# EAGLE design clock (EAGLE 9.6.1)
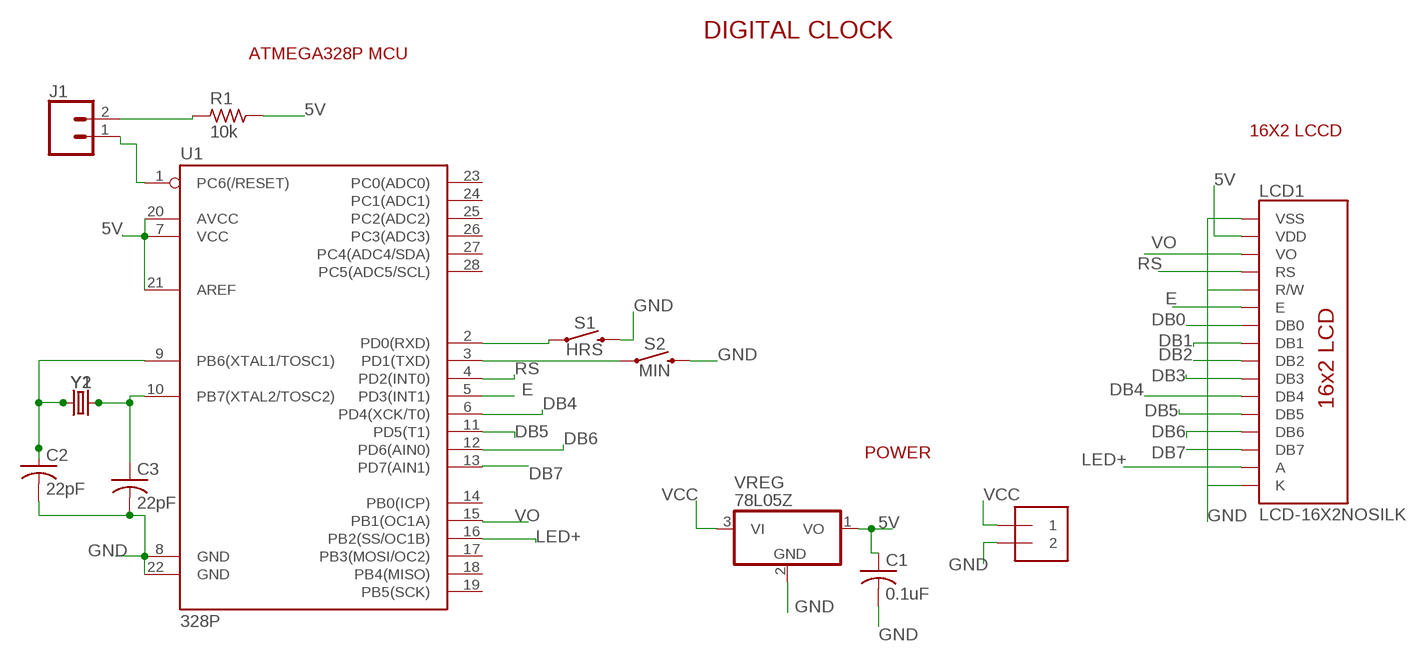
[diagram p0: schematic, sheet 1]

## Parts
C1  0.1uF  C-USC1206  [C1206]
C2  22pF  C-USC1206  [C1206]
C3  22pF  C-USC1206  [C1206]
J1  CONN_02  [1X02]
LCD1  LCD-16X2NOSILK  [LCD-16X2_NOSILK]
POWER  1X2-3.5MM  [1X2-3.5MM]
R1  10k  R_1206  [R1206]
S1  HRS  MOMENTARY-SWITCH-SPST-PTH-6.0MM  [TACTILE_SWITCH_PTH_6.0MM]
S2  MIN  MOMENTARY-SWITCH-SPST-PTH-6.0MM  [TACTILE_SWITCH_PTH_6.0MM]
U1  328P  ATMEGA328P_PDIP  [DIP28]
VREG  78L05Z  [TO92]
Y1  CRYSTALPTH-HC49US  [HC49US]
Y2  CRYSTALPTH-HC49US  [HC49US]

## Nets
5V: C1.1 LCD1.2(VDD) R1.2 U1.7(VCC) U1.20(AVCC) U1.21(AREF) VREG.1(VO)
DB0: LCD1.7(DB0)
DB1: LCD1.8(DB1)
DB2: LCD1.9(DB2)
DB3: LCD1.10(DB3)
DB4: LCD1.11(DB4) U1.6(PD4(XCK/T0))
DB5: LCD1.12(DB5) U1.11(PD5(T1))
DB6: LCD1.13(DB6) U1.12(PD6(AIN0))
DB7: LCD1.14(DB7) U1.13(PD7(AIN1))
E: LCD1.6(E) U1.5(PD3(INT1))
GND: C1.2 C2.1 C2.2 C3.2 LCD1.16(K) POWER.2 S1.3 S2.3 U1.8(GND) U1.9(PB6(XTAL1/TOSC1)) U1.22(GND) VREG.2(GND) Y1.1 Y2.1
LED+: LCD1.15(A) U1.16(PB2(SS/OC1B))
N$1: LCD1.1(VSS) LCD1.5(R/W)
N$2: S1.1 U1.2(PD0(RXD))
N$3: S2.1 U1.3(PD1(TXD))
N$4: J1.1 U1.1(PC6(/RESET))
N$5: J1.2 R1.1
N$6: C3.1 U1.10(PB7(XTAL2/TOSC2)) Y1.2 Y2.2
RS: LCD1.4(RS) U1.4(PD2(INT0))
VCC: POWER.1 VREG.3(VI)
VO: LCD1.3(VO) U1.15(PB1(OC1A))
Unconnected: U1.14(PB0(ICP)) U1.17(PB3(MOSI/OC2)) U1.18(PB4(MISO)) U1.19(PB5(SCK)) U1.23(PC0(ADC0)) U1.24(PC1(ADC1)) U1.25(PC2(ADC2)) U1.26(PC3(ADC3)) U1.27(PC4(ADC4/SDA)) U1.28(PC5(ADC5/SCL))

## Notes on the sheet
- DIGITAL CLOCK
- ATMEGA328P MCU
- 16X2 LCCD
- POWER

## Library data of the parts
C1-C3 = adafruit:C-US: CAPACITOR, American symbol
J1 = SparkFun-Connectors:CONN_02: Multi connection point. Often used as Generic Header-pin footprint for 0.1 inch spaced/style header connections On any of the 0.1 inch spaced packages, you can populate with these: Break Away Headers - Straight <https://www.sparkfun.com/products/116> (PRT-00116) Break Away Male Headers - Right Angle <https://www.sparkfun.com/products/553> (PRT-00553) Female Headers <https://www.sparkfun.com/products/115> (PRT-00115) Break Away Headers - Machine Pin <https://www.sparkfun.com/products/117> (PRT-00117) Break Away Female Headers - Swiss Machine Pin <https://www.sparkfun.com/products/743> (PRT-00743) For SCREWTERMINALS and SPRING TERMINALS visit here: Screw Terimnals on SparkFun.com <https://www.sparkfun.com/search/results?term=Screw+Terminals> (5mm/3.5mm/2.54mm spacing) This device is also useful as a general connection point to wire up your design to another part of your project. Our various solder wires solder well into these plated through hole pads. Hook-Up Wire - Assortment (Stranded, 22 AWG) <https://www.sparkfun.com/products/11375> (PRT-11375) Hook-Up Wire - Assortment (Solid Core, 22 AWG) <https://www.sparkfun.com/products/11367> (PRT-11367) View the entire wire category on our website here <https://www.sparkfun.com/categories/141> Special notes: Molex polarized connector foot print use with: PRT-08233 with associated crimp pins and housings. 2.54_SCREWTERM for use with PRT-10571. 3.5mm Screw Terminal footprints for PRT-08084 5mm Screw Terminal footprints for use with PRT-08432
LCD1 = SparkFun-Displays:LCD-16X2: Standard text-only 16x2 parallel input LCD Basic 16 character by 2 line display. Typically utilizes the extremely common HD44780 parallel interface chipset SparkFun Products: Basic 16x2 Green <https://www.sparkfun.com/products/255> Basic 8x2 Green <https://www.sparkfun.com/products/11122>; SF_ID: LCD-00255
POWER = adafruit:1X2: 3.5mm Terminal block http://www.ladyada.net/library/pcb/eaglelibrary.html
R1 = rc-master-smd:R_: RESISTOR
S1 S2 = SparkFun-Switches:MOMENTARY-SWITCH-SPST: Momentary Switch (Pushbutton) - SPST Normally-open (NO) SPST momentary switches (buttons, pushbuttons). Variants PTH-12MM - 12mm square, through-hole Momentary Pushbutton Switch - 12mm Square <https://www.sparkfun.com/products/9190> (COM-09190) PTH-6.0MM, PTH-6.0MM-KIT - 6.0mm square, through-hole Mini Pushbutton Switch <https://www.sparkfun.com/products/97> (COM-00097) KIT package intended for soldering kit's - only one side of pads' copper is exposed. PTH-RIGHT-ANGLE-KIT - Right-angle, through-hole Right Angle Tactile Button <https://www.sparkfun.com/products/10791> - Used on SparkFun BigTime Watch Kit <https://www.sparkfun.com/products/11734> SMD-12MM - 12mm square, surface-mount Tactile Button - SMD (12mm) <https://www.sparkfun.com/products/12993> (COM-12993) Used on SparkFun PicoBoard <https://www.sparkfun.com/products/11888> SMD-4.5MM - 4.5mm Square Trackball Switch Used on SparkFun Blackberry Trackballer Breakout <https://www.sparkfun.com/products/13169> SMD-4.6MMX2.8MM - 4.60mm x 2.80mm, surface mount Used on SparkFun SAMD21 Mini Breakout <https://www.sparkfun.com/products/13664> SMD-5.2MM, SMD-5.2-REDUNDANT - 5.2mm square, surface-mount Mini Pushbutton Switch - SMD <https://www.sparkfun.com/products/8720> (COM-08720) Used on Arduino Pro Mini <https://www.sparkfun.com/products/11114> REDUNDANT package connects both switch circuits together SMD-6.0X3.5MM - 6.0 x 3.5mm, surface mount Momentary Reset Switch SMD <https://www.sparkfun.com/products/8229> (COM-08229) SMD-6.2MM-TALL - 6.2mm square, surface mount Tactile Button - SMD (6mm) <https://www.sparkfun.com/products/12992> Used on SparkFun Digital Sandbox <https://www.sparkfun.com/products/12651> SMD-RIGHT-ANGLE - Right-angle, surface mount Used on SparkFun Block for Intel® Edison - Arduino <https://www.sparkfun.com/products/13036>; PROD_ID: SWCH-08441; SF_SKU: COM-00097
U1 = SparkFun-IC-Microcontroller:ATMEGA328P_PDIP: Atmel 328P Through hole ATMEGA328P uC used in the Arduino 32kb flash, 1k EEPROM, 2k SRAM Datasheet <http://www.sparkfun.com/datasheets/Components/SMD/ATMega328.pdf> SparkFun Products Storefront component: AVR 28 Pin 20MHz 32K 6A/D - ATMega328P <https://www.sparkfun.com/products/9061> (COM-09061) SparkFun Simon Says - Through-Hole Soldering Kit <https://www.sparkfun.com/products/10547> (KIT-10547) SparkFun Learn to Solder - Simon Says <https://www.sparkfun.com/products/13708> (KIT-13708) SparkFun BigTime Watch Kit <https://www.sparkfun.com/products/11734> (KIT-11734) SparkFun ClockIt <https://www.sparkfun.com/products/10930> (KIT-10930) SparkFun Serial Enabled LCD Kit <https://www.sparkfun.com/products/10097> (LCD-10097) SparkFun Simon Tilts - Through Hole Soldering Kit <https://www.sparkfun.com/products/12634> (KIT-12634) SparkFun Frequency Counter Kit <https://www.sparkfun.com/products/10140> (KIT-10140) FabFM Radio Kit <https://www.sparkfun.com/products/11043> (KIT-11043) SparkFun Binary Blaster Kit <https://www.sparkfun.com/products/12037> (KIT-12037) SparkFun Metro-Gnome <https://www.sparkfun.com/products/9236> (KIT-09236) ATmega328 with Arduino Optiboot (Uno) <https://www.sparkfun.com/products/10524> (DEV-10524); PROD_ID: IC-09136
VREG = adafruit:78*: Positive VOLTAGE REGULATOR Added bigger pads to the TO-92 package
Y1 Y2 = SparkFun-Clocks:CRYSTAL: Crystals (Generic) These are passive quartz crystals, which can be used as a clock source for a microcontroller. Crystal's are two-terminal devices. They require external "load" capacitors to generate an oscillating signal.

## Board
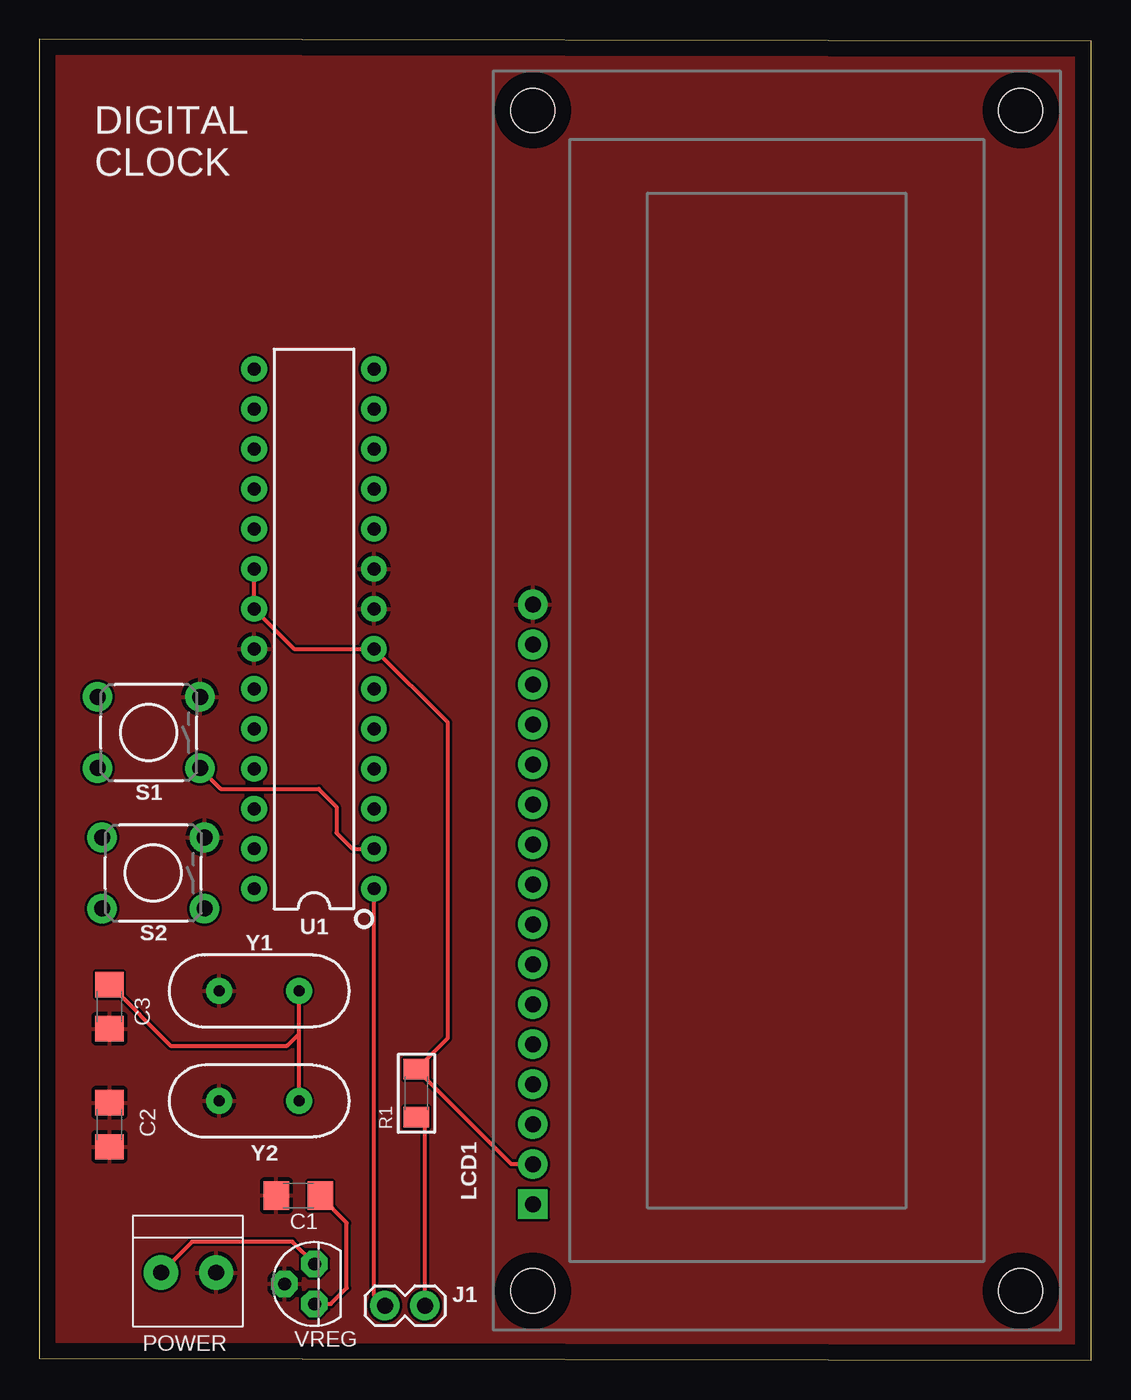
[diagram p1: board, top side]
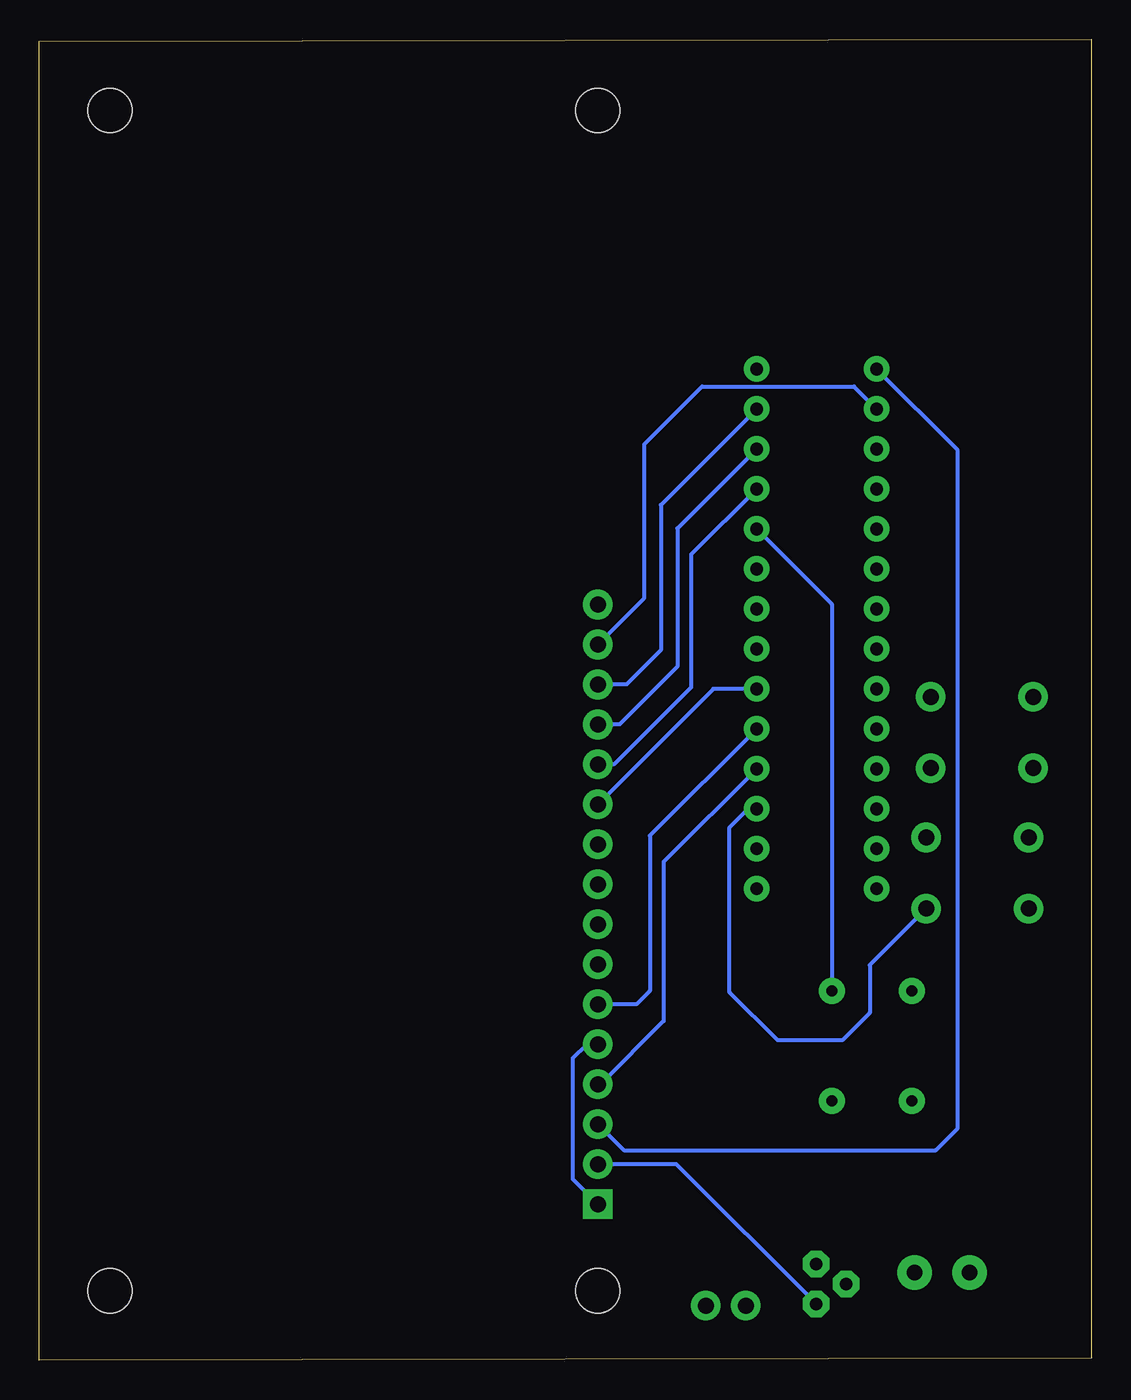
[diagram p2: board, bottom side, seen from below]

Size 66.85 x 83.92 mm. Coordinates in mm from the lower left corner, seen from the top.
Outline: 0,0.11 66.85,0 66.85,83.81 0,83.92 0,0.11
Copper layers (1*16): Top 0.035mm / dielectric 1.5mm / Bottom 0.035mm
Design rules "default": minimum track width 6mil, minimum drill 0.35mm, track to track 6mil, track to pad 6mil, pad to pad 6mil, via to via 6mil, smd to smd 6mil, copper to edge 40mil, drill to drill 6mil, minimum pad ring 10mil, minimum via ring 8mil, stop-mask expansion 4mil, vias tented up to drill 0mil, thermal gap 10mil

### Footprints (pad centres in the part's own frame; a part is rotated, then mirrored left to right if it is on the bottom)
C1206 = smd 1.6 x 1.8: 1 -1.4,0; 2 1.4,0
1X02 = drill 1.016 pad 1.88: 1 0,0; 2 2.54,0
LCD-16X2_NOSILK = drill 1.016 pad 1.88 square: 1 -32,15.5 | drill 1.016 pad 1.88: 2 -29.46,15.5; 3 -26.92,15.5; 4 -24.38,15.5; 5 -21.84,15.5; 6 -19.3,15.5; 7 -16.76,15.5; 8 -14.22,15.5; 9 -11.68,15.5; 10 -9.14,15.5; 11 -6.6,15.5; 12 -4.06,15.5; 13 -1.52,15.5; 14 1.02,15.5; 15 3.56,15.5; 16 6.1,15.5 | hole 2.8: -37.5,15.5; -37.5,-15.5; 37.5,15.5; 37.5,-15.5
1X2-3.5MM = drill 1 pad 2.184: 1 1.8,0; 2 -1.7,0
R1206 = smd 1.3 x 1.6: 1 -1.524,0; 2 1.524,0
TACTILE_SWITCH_PTH_6.0MM = drill 1.016 pad 1.88: 1 -3.251,2.261; 2 3.251,2.261; 3 -3.251,-2.261; 4 3.251,-2.261
DIP28 = drill 0.813 pad 1.626: 1 -16.51,-3.81; 2 -13.97,-3.81; 3 -11.43,-3.81; 4 -8.89,-3.81; 5 -6.35,-3.81; 6 -3.81,-3.81; 7 -1.27,-3.81; 8 1.27,-3.81; 9 3.81,-3.81; 10 6.35,-3.81; 11 8.89,-3.81; 12 11.43,-3.81; 13 13.97,-3.81; 14 16.51,-3.81; 15 16.51,3.81; 16 13.97,3.81; 17 11.43,3.81; 18 8.89,3.81; 19 6.35,3.81; 20 3.81,3.81; 21 1.27,3.81; 22 -1.27,3.81; 23 -3.81,3.81; 24 -6.35,3.81; 25 -8.89,3.81; 26 -11.43,3.81; 27 -13.97,3.81; 28 -16.51,3.81
TO92 = drill 0.813 pad 1.676 octagon: 1 -1.27,0; 2 0,1.905; 3 1.27,0
HC49US = drill 0.7 pad 1.651: 1 -2.54,0; 2 2.54,0

### Placement (x,y rotation side)
C1  16.46,10.46 180 top
C2  4.46,14.96 270 top
C3  4.46,22.46 270 top
J1  21.96,3.46 0 top
LCD1  46.86,41.91 90 top
POWER  9.54,5.56 180 top
R1  23.96,16.96 90 top
S1  6.95,39.88 180 top
S2  7.24,30.95 180 top
U1  17.46,46.46 90 top
VREG  17.49,4.84 90 top
Y1  13.96,23.46 0 top
Y2  13.96,16.46 0 top

### Tracks (layer width: path | path; a pad name or v marks a point on that pad's centre or on a via)
5V
  Top 0.254: LCD1.2 29.99,12.45 R1.2 25.96,20.48 25.96,23.03 25.96,23.21 25.96,40.5 U1.7 16.19,45.19 U1.21 U1.20 | VREG.1 18.51,3.57 19.54,4.59 19.54,8.72 17.86,10.4 C1.1
  Bottom 0.254: VREG.1 26.37,12.45 LCD1.2
DB4
  Bottom 0.254: U1.6 24.02,42.65 LCD1.11
DB5
  Bottom 0.254: U1.11 25.43,51.19 25.43,42.75 30.33,37.85 LCD1.12
DB6
  Bottom 0.254: U1.12 26.3,52.85 26.3,44.06 29.98,40.39 LCD1.13
DB7
  Bottom 0.254: U1.13 27.35,54.34 27.35,45.11 29.53,42.93 LCD1.14
E
  Bottom 0.254: U1.5 28.05,33.33 28.05,23.47 28.91,22.61 LCD1.6
GND
  pour Top: -2.71,84.28 -2.71,-1.45 68.01,-1.45 68.12,-1.34 68.12,84.61 68.01,84.71 -2.71,84.71 -2.82,84.82 -2.82,84.39
LED+
  Bottom 0.254: LCD1.15 28.4,48.43 28.4,58.2 24.73,61.87 15.08,61.87 U1.16
N$1
  Bottom 0.254: LCD1.1 32.94,11.49 32.94,19.19 32.06,20.07 LCD1.5
N$2
  Top 0.254: S1.1 11.53,36.3 17.75,36.3 18.88,35.16 18.88,33.5 19.9,32.49 U1.2
N$3
  Bottom 0.254: S2.1 14.08,25.1 14.08,22.07 15.83,20.32 19.93,20.32 22.99,23.38 22.99,33.85 21.81,35.03 U1.3
N$4
  Top 0.254: J1.1 21.27,4.15 U1.1
N$5
  Top 0.254: J1.2 24.5,14.9 R1.1
N$6
  Top 0.254: C3.1 8.34,19.98 15.74,19.98 16.5,20.73 | 16.5,20.73 Y1.2 | Y2.2 16.5,20.73
  Bottom 0.254: U1.10 16.5,48.04 Y1.2
RS
  Bottom 0.254: U1.4 27.18,31.66 27.18,21.55 31.19,17.53 LCD1.4
VCC
  Top 0.254: POWER.1 9.7,7.53 16.07,7.53 VREG.3
VO
  Bottom 0.254: LCD1.3 29.71,13.34 9.89,13.34 8.5,14.74 8.5,57.82 U1.15

### Text on the board
tSilk: DIGITAL / CLOCK